# EAGLE design ModemPLN_V2wired (EAGLE 9.6.2)
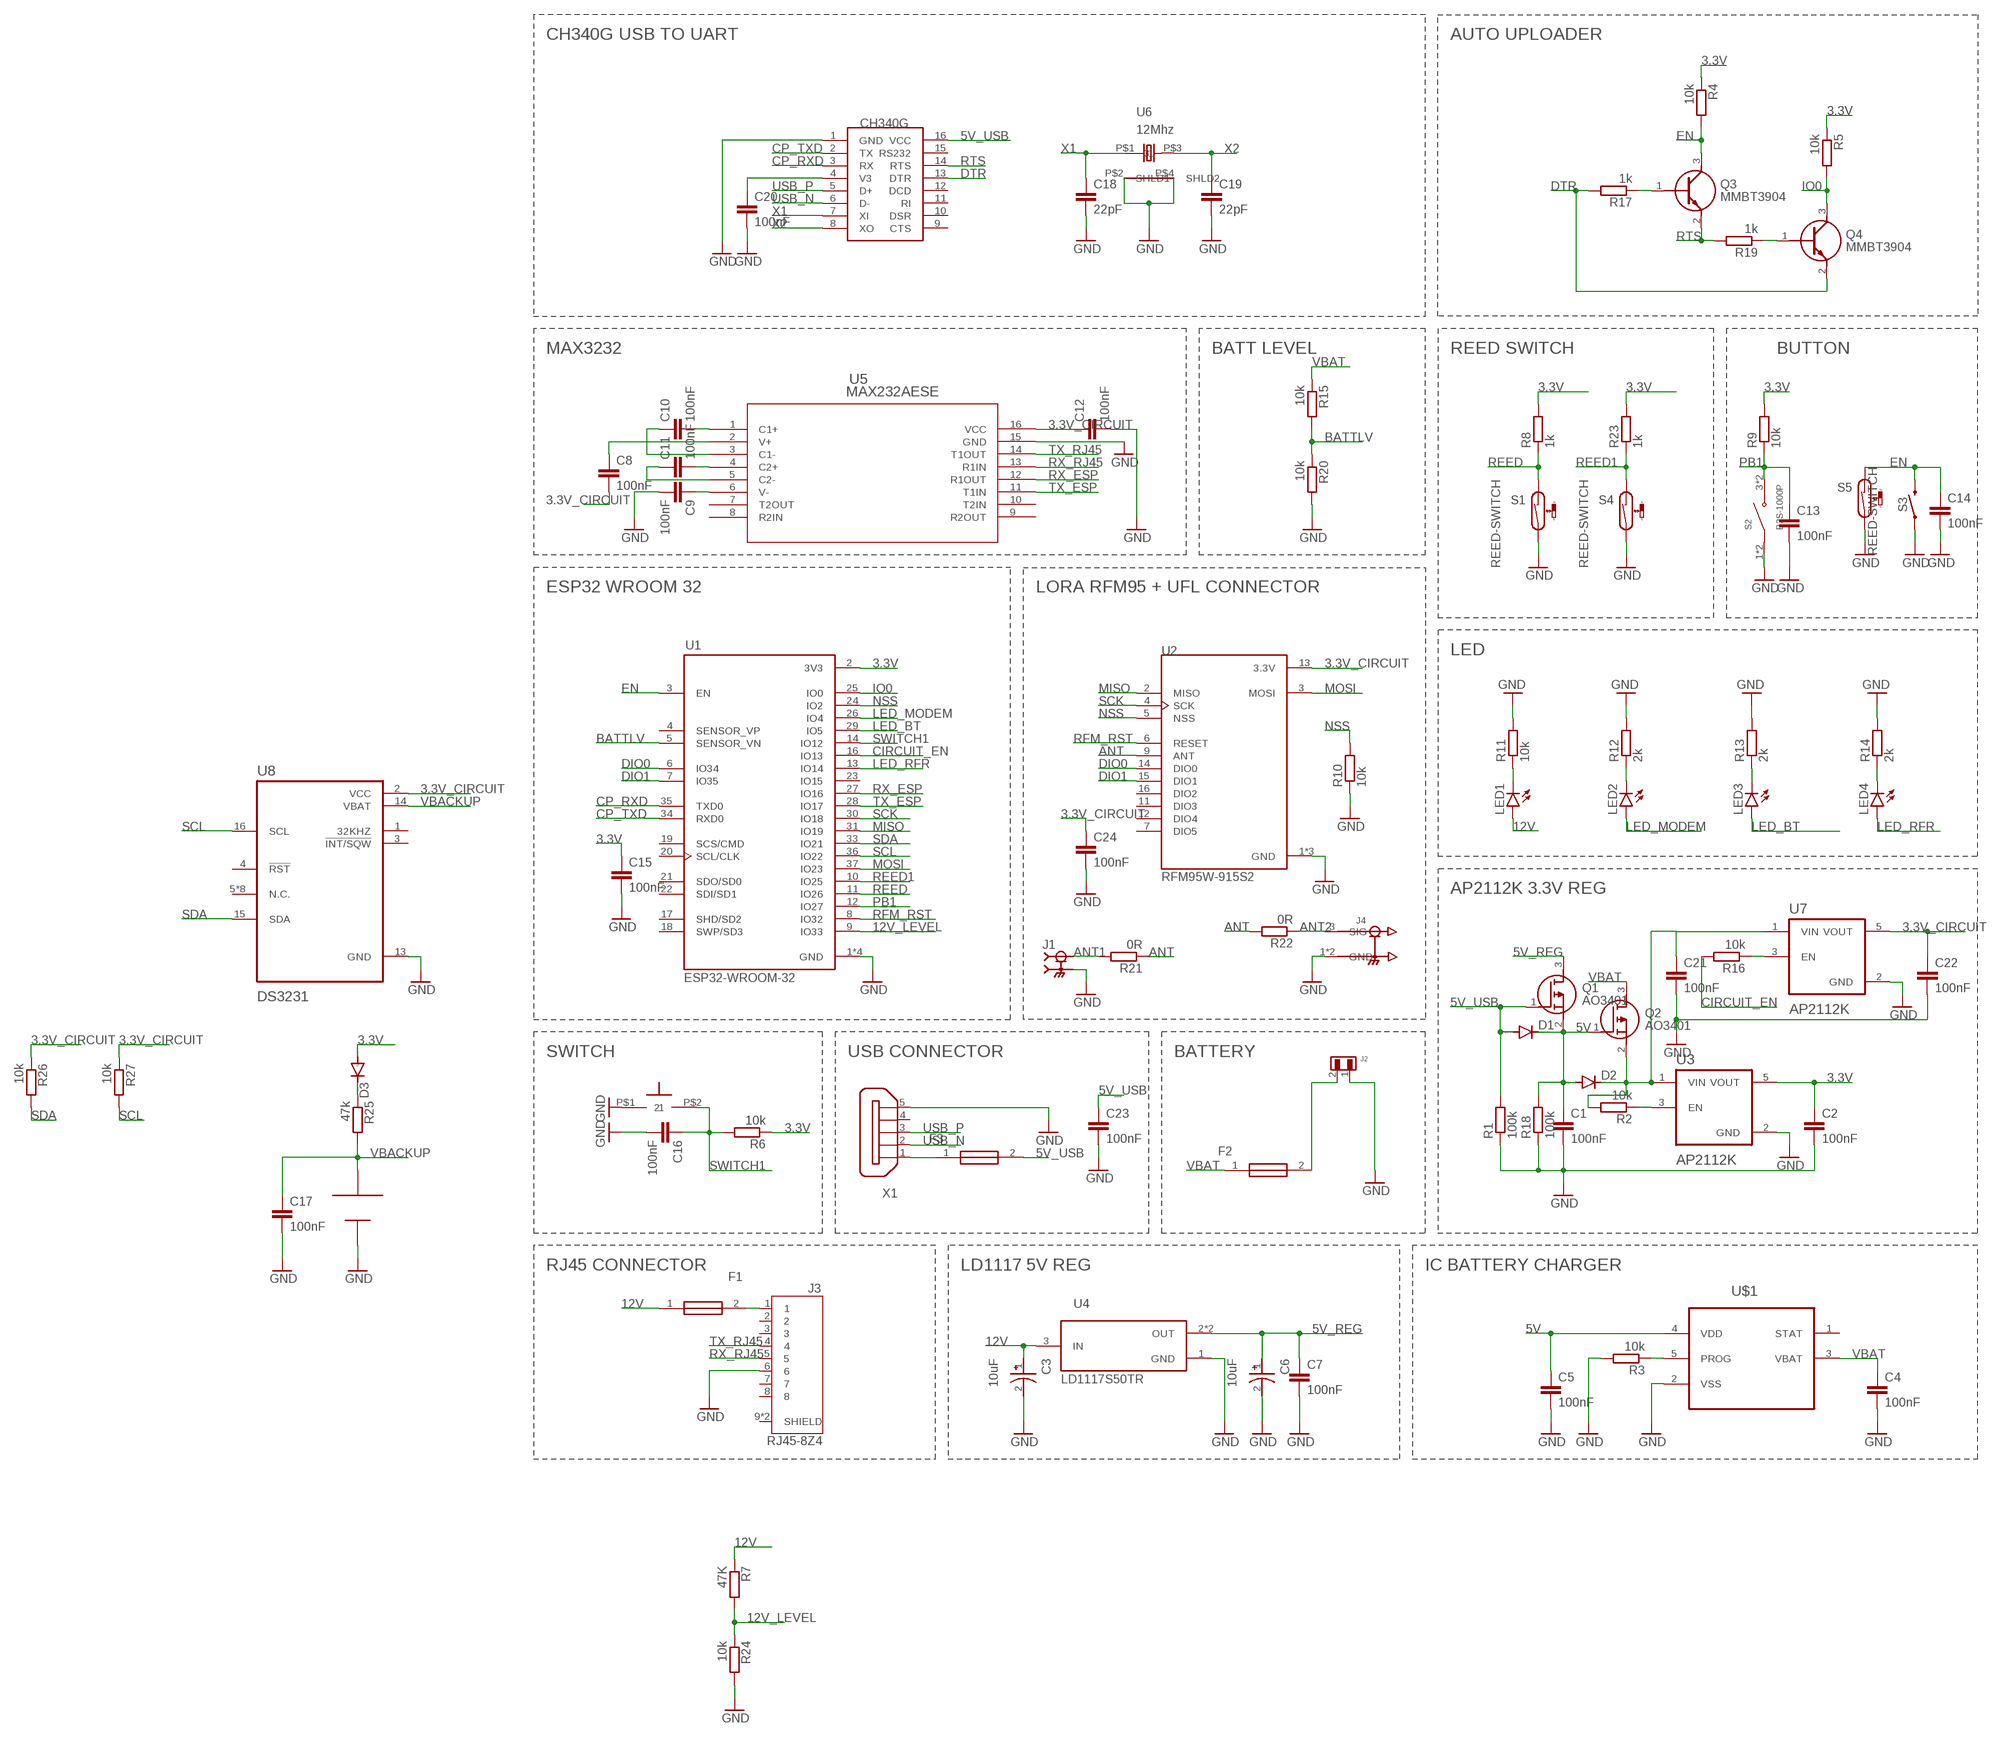
[diagram p0: schematic, sheet 1]

## Parts
C1  100nF  C-EUC0603  [C0603]
C2  100nF  C-EUC0603  [C0603]
C3  10uF  T543B106M025ATS100  [CAPPM3528X210N]
C4  100nF  C-EUC0603  [C0603]
C5  100nF  C-EUC0603  [C0603]
C6  10uF  T543B106M025ATS100  [CAPPM3528X210N]
C7  100nF  C-EUC0603  [C0603]
C8  100nF  C-EUC0603  [C0603]
C9  100nF  C-EUC0603  [C0603]
C10  100nF  C-EUC0603  [C0603]
C11  100nF  C-EUC0603  [C0603]
C12  100nF  C-EUC0603  [C0603]
C13  100nF  C-EUC0603  [C0603]
C14  100nF  C-EUC0603  [C0603]
C15  100nF  C-EUC0603  [C0603]
C16  100nF  C-EUC0603  [C0603]
C17  100nF  C-EUC0603  [C0603]
C18  22pF  C-EUC0603  [C0603]
C19  22pF  C-EUC0603  [C0603]
C20  100nF  C-EUC0603  [C0603]
C21  100nF  C-EUC0603  [C0603]
C22  100nF  C-EUC0603  [C0603]
C23  100nF  C-EUC0603  [C0603]
C24  100nF  C-EUC0603  [C0603]
D1  DIODE-DO214AC  [DO214AC]
D2  DIODE-DO214AC  [DO214AC]
D3  DIODE-DO214AC  [DO214AC]
F1  MF-NSML260_12-2  [FUSC3216X100N]
F2  MF-NSML260_12-2  [FUSC3216X100N]
F3  MF-NSML260_12-2  [FUSC3216X100N]
J1  SMA-J-P-X-RA-TH1  [SAMTEC_SMA-J-P-X-RA-TH1]
J2  620102131822  [620102131822]
J3  RJ45-8Z4  [TE_RJ45-8Z4]
J4  U.FL-R-SMT(01)  [HRS_U.FL-R-SMT(01)]
LED1  LEDCHIPLED_0805  [CHIPLED_0805]
LED2  LEDCHIPLED_0805  [CHIPLED_0805]
LED3  LEDCHIPLED_0805  [CHIPLED_0805]
LED4  LEDCHIPLED_0805  [CHIPLED_0805]
Q1  AO3401  AO3401A  [SOT95P280X125-3N]
Q2  AO3401  AO3401A  [SOT95P280X125-3N]
Q3  MMBT3904  [SOT95P240X120-3N]
Q4  MMBT3904  [SOT95P240X120-3N]
R1  100k  R-EU_R0603  [R0603]
R2  10k  R-EU_R0603  [R0603]
R3  10k  R-EU_R0603  [R0603]
R4  10k  R-EU_R0603  [R0603]
R5  10k  R-EU_R0603  [R0603]
R6  10k  R-EU_R0603  [R0603]
R7  47K  R-EU_R0603  [R0603]
R8  1k  R-EU_R0603  [R0603]
R9  10k  R-EU_R0603  [R0603]
R10  10k  R-EU_R0603  [R0603]
R11  10k  R-EU_R0603  [R0603]
R12  2k  R-EU_R0603  [R0603]
R13  2k  R-EU_R0603  [R0603]
R14  2k  R-EU_R0603  [R0603]
R15  10k  R-EU_R0603  [R0603]
R16  10k  R-EU_R0603  [R0603]
R17  1k  R-EU_R0603  [R0603]
R18  100k  R-EU_R0603  [R0603]
R19  1k  R-EU_R0603  [R0603]
R20  10k  R-EU_R0603  [R0603]
R21  0R  R-EU_R0603  [R0603]
R22  0R  R-EU_R0603  [R0603]
R23  1k  R-EU_R0603  [R0603]
R24  10k  R-EU_R0603  [R0603]
R25  47k  R-EU_R0603  [R0603]
R26  10k  R-EU_R0603  [R0603]
R27  10k  R-EU_R0603  [R0603]
S1  REED-SWITCH  REED-SWITCH-MK15-B  [MK15]
S2  B3S-1000P  [SW_B3S-1000P]
S3  MOMENTARY-SWITCH-SPST-SMD-6.0X3.5MM  [TACTILE_SWITCH_SMD_6.0X3.5MM]
S4  REED-SWITCH  REED-SWITCH-MK15-B  [MK15]
S5  REED-SWITCH  REED-SWITCH-MK15-B  [MK15]
U1  ESP32-WROOM-32  ESP32-WROOM-32(8MB)  [MODULE_ESP32-WROOM-32(8MB)]
U2  RFM95W-915S2  [XCVR_RFM95W-915S2]
U3  AP2112K  AP2112K-3.3TRG1  [SOT95P285X140-5N]
U4  LD1117S50TR  [SOT230P700X180-4N]
U5  MAX232AESE  [21-0041B_16]
U6  12Mhz  NX3225SA  [NX32256A]
U7  AP2112K  AP2112K-3.3TRG1  [SOT95P285X140-5N]
U8  DS3231  DS3231S  [SOIC127P1032X265-16N]
U$1  MCP73831T-5ACI/OT  [SOT95P280X145-5N]
U$2  TACTSWITCH  [TACT]
U$3  MS621FE  [MS621FE]
U$4  CH340G  CH340G-3D  [SOIC127P600X175-16N]
X1  ZX62D-B-5PA8  [ZX62D-B-5PA8]

## Nets
3.3V: C2.1 C15.1 D3.A R4.1 R5.1 R6.1 R8.2 R9.2 R23.2 U1.2(3V3) U3.5(VOUT)
3.3V_CIRCUIT: C8.2 C12.1 C22.1 C24.1 R26.1 R27.1 U2.13(3.3V) U5.16(VCC) U7.5(VOUT) U8.2(VCC)
5V: C1.1 C5.1 D1.C D2.A Q1.2(S) Q2.1(G) R18.2 U$1.4(VDD)
5V_REG: C6.1 C7.1 Q1.3(D) U4.2(OUT) U4.4(OUT)
5V_USB: C23.1 D1.A F3.2 Q1.1(G) R1.2 U$4.16(VCC)
12V: C3.1 F1.1 LED1.A R7.1 U4.3(IN)
12V_LEVEL: R7.2 R24.1 U1.9(IO33)
ANT: R21.1 R22.2 U2.9(ANT)
ANT1: J1.1 R21.2
ANT2: J4.3(SIG) R22.1
BATTLV: R15.2 R20.1 U1.5(SENSOR_VN)
CIRCUIT_EN: R16.2 U1.16(IO13)
CP_RXD: U1.35(TXD0) U$4.3(RX)
CP_TXD: U1.34(RXD0) U$4.2(TX)
DIO0: U1.6(IO34) U2.14(DIO0)
DIO1: U1.7(IO35) U2.15(DIO1)
DTR: Q4.2(E) R17.2 U$4.13(DTR)
EN: C14.1 Q3.3(C) R4.2 S3.2 S5.1 U1.3(EN)
GND: C1.2 C2.2 C3.2 C4.2 C5.2 C6.2 C7.2 C9.2 C12.2 C13.2 C14.2 C15.2 C16.2 C17.2 C18.2 C19.2 C20.2 C21.2 C22.2 C23.2 C24.2 J1.2 J1.3 J1.4 J1.5 J2.1 J3.6 J4.1(GND) J4.2(GND) R1.1 R3.2 R10.1 R11.2 R12.2 R13.2 R14.2 R18.1 R20.2 R24.2 S1.2 S2.1(COM) S2.2(COM) S3.1 S4.2 S5.2 U1.1(GND) U1.15(GND) U1.38(GND) U1.39(GND) U2.1(GND) U2.8(GND) U2.10(GND) U3.2(GND) U4.1(GND) U5.15(GND) U6.P$2(SHLD1) U6.P$4(SHLD2) U7.2(GND) U8.13(GND) U$1.2(VSS) U$2.P$1 U$3.V- U$4.1(GND) X1.5
IO0: Q4.3(C) R5.2 U1.25(IO0)
LED_BT: LED3.A U1.29(IO5)
LED_MODEM: LED2.A U1.26(IO4)
LED_RFR: LED4.A U1.13(IO14)
MISO: U1.31(IO19) U2.2(MISO)
MOSI: U1.37(IO23) U2.3(MOSI)
N$1: LED1.C R11.1
N$2: F1.2 J3.1
N$3: R16.1 U7.3(EN)
N$4: R2.1 U3.3(EN)
N$5: R3.1 U$1.5(PROG)
N$6: C9.1 U5.6(V-)
N$7: LED2.C R12.1
N$8: C11.2 U5.4(C2+)
N$9: C11.1 U5.5(C2-)
N$10: C10.2 U5.1(C1+)
N$11: C10.1 U5.3(C1-)
N$12: LED3.C R13.1
N$13: LED4.C R14.1
N$14: C21.1 D2.C Q2.2(S) R2.2 U3.1(VIN) U7.1(VIN)
N$15: C20.1 U$4.4(V3)
N$17: C8.1 U5.2(V+)
N$18: F3.1 X1.1
N$19: D3.C R25.1
N$20: Q3.1(B) R17.1
N$23: Q4.1(B) R19.1
N$26: F2.2 J2.2
NSS: R10.2 U1.24(IO2) U2.5(NSS)
PB1: C13.1 R9.1 S2.3(NO) S2.4(NO) U1.12(IO27)
REED: R8.1 S1.1 U1.11(IO26)
REED1: R23.1 S4.1 U1.10(IO25)
RFM_RST: U1.8(IO32) U2.6(RESET)
RTS: Q3.2(E) R19.2 U$4.14(RTS)
RX_ESP: U1.27(IO16) U5.12(R1OUT)
RX_RJ45: J3.5 U5.13(R1IN)
SCK: U1.30(IO18) U2.4(SCK)
SCL: R27.2 U1.36(IO22) U8.16(SCL)
SDA: R26.2 U1.33(IO21) U8.15(SDA)
SWITCH1: C16.1 R6.2 U1.14(IO12) U$2.P$2
TX_ESP: U1.28(IO17) U5.11(T1IN)
TX_RJ45: J3.4 U5.14(T1OUT)
USB_N: U$4.6(D-) X1.2
USB_P: U$4.5(D+) X1.3
VBACKUP: C17.1 R25.2 U8.14(VBAT) U$3.V+
VBAT: C4.1 F2.1 Q2.3(D) R15.1 U$1.3(VBAT)
X1: C18.1 U6.P$1 U$4.7(XI)
X2: C19.1 U6.P$3 U$4.8(XO)
Unconnected: J3.2 J3.3 J3.7 J3.8 J3.9(SHIELD) J3.10(SHIELD) U1.4(SENSOR_VP) U1.17(SHD/SD2) U1.18(SWP/SD3) U1.19(SCS/CMD) U1.20(SCL/CLK) U1.21(SDO/SD0) U1.22(SDI/SD1) U1.23(IO15) U2.7(DIO5) U2.11(DIO3) U2.12(DIO4) U2.16(DIO2) U5.7(T2OUT) U5.8(R2IN) U5.9(R2OUT) U5.10(T2IN) U8.1(32KHZ) U8.3(!INT/SQW) U8.4(!RST) U8.5(N.C.) U8.6(N.C.) U8.7(N.C.) U8.8(N.C.) U8.9(N.C.) U8.10(N.C.) U8.11(N.C.) U8.12(N.C.) U$1.1(STAT) U$4.9(CTS) U$4.10(DSR) U$4.11(RI) U$4.12(DCD) U$4.15(RS232) X1.4 X1.S1 X1.S2 X1.S3 X1.S4

## Notes on the sheet
- CH340G USB TO UART | AUTO UPLOADER
- MAX3232 | BATT LEVEL | REED SWITCH | BUTTON
- ESP32 WROOM 32 | LORA RFM95 + UFL CONNECTOR
- LED
- AP2112K 3.3V REG
- SWITCH | USB CONNECTOR | BATTERY
- RJ45 CONNECTOR | LD1117 5V REG | IC BATTERY CHARGER

## Library data of the parts
C1 C2 C4 C5 C7-C24 = rcl:C-EU: CAPACITOR, European symbol; SPICEPREFIX: C
C3 C6 = T543B106M025ATS100:T543B106M025ATS100: Check prices <https://pricing.snapeda.com/parts/T543B106M025ATS100/KEMET/view-part?ref=eda>; AVAILABILITY: Not in stock; DESCRIPTION: CAP TANT POLY 10UF 25V 3528; MF: KEMET; MP: T543B106M025ATS100; PACKAGE: 1411 KEMET; PRICE: None
D1-D3 = diode:DIODE-: DIODE
F1-F3 = MF-NSML260_12-2:MF-NSML260_12-2: Resettable Fuses - PPTC 2.6A 12V 1206 LOW-OHMIC Source: Datasheet <https://www.bourns.com/docs/product-datasheets/mf-nsml-x.pdf>; ARROW_PART_NUMBER: MF-NSML260/12-2; ARROW_PRICE-STOCK: https://www.arrow.com/en/products/mf-nsml26012-2/bourns; DESCRIPTION: Resettable Fuses - PPTC 2.6A 12V 1206 LOW-OHMIC; HEIGHT: 1mm; MANUFACTURER_NAME: Bourns; MANUFACTURER_PART_NUMBER: MF-NSML260/12-2; MOUSER_PART_NUMBER: 652-MF-NSML260/12-2; MOUSER_PRICE-STOCK: https://www.mouser.com/Search/Refine.aspx?Keyword=652-MF-NSML260%2F12-2
J1 = SMA-J-P-X-RA-TH1:SMA-J-P-X-RA-TH1: SMA Connector Jack, Female Socket 50Ohm Through Hole, Right Angle Solder Check prices <https://pricing.snapeda.com/parts/SMA-J-P-H-RA-TH1/Samtec/view-part?ref=eda>; AVAILABILITY: In Stock; DESCRIPTION: SMA Connector Jack, Female Socket 50Ohm Through Hole, Right Angle Solder; MF: Samtec; MP: SMA-J-P-H-RA-TH1; PACKAGE: None; PRICE: None; PURCHASE-URL: https://pricing.snapeda.com/search/part/SMA-J-P-H-RA-TH1/?ref=eda
J2 = Wurth_Connectors_WR-WTB:620102131822: WR-WTB 2.00 mm SMT Male Horizontal Shrouded Header KIND PROPERTIES: Pitch:2 mm Gender:Male MATERIAL PROPERTIES: Insulator Material :PA9T Insulator Flammability Rating:UL94 V-0 Color:Beige Contact Material:Copper Alloy Contact Plating:Tin Contact Type:Stamped GENERAL INFORMATION Operating Temperature:-25 up to +85 °C Compliance: RoHS Working Voltage:100 V (AC) Withstanding Voltage:800V (AC) Contact Resistance:20 mΩ RISO:1000 MΩ CERTIFICATION UL Approval:E323964 PACKAGING PROPERTIES Packaging:Tape and Reel <https://katalog.we-online.com/media/images/v2/o33353v209%20Family_WR-WTB_6201xx131822.jpg> Details see: https://katalog.we-online.com/en/em/WTB_2_00_SMT_MALE_HORIZONTAL_SHROUDED_HEADER_6201XX131822 Updated by Yingchun,Shan 2019-11-08 2019 (C) Würth Elektronik; CONTACT-RESISTANCE: 20mOhm; DATASHEET-URL: https://www.we-online.com/catalog/datasheet/620102131822.pdf; GENDER: Male; IR: 2A; L: 8mm; MOUNT: SMT; PACKAGING: Tape and Reel; PART-NUMBER: 620102131822; PCB-CABLE-PANEL: PCB; PINS: 2; PITCH: 2mm; TOL-R: max.; TYPE: Horizontal; USE-WITH: WR-WTB 2.00 mm Female Terminal Housing; VALUE: 620102131822; WORKING-VOLTAGE: 100V(AC)
J3 = RJ45-8Z4:RJ45-8Z4: CONN MOD JACK 8P8C R/A SHIELDED Check prices <https://pricing.snapeda.com/parts/RJ45-8Z4/TE%20Connectivity/view-part?ref=eda>; AVAILABILITY: In Stock; DESCRIPTION: Jack Modular Connector 8p8c (RJ45, Ethernet) 90° Angle (Right) Shielded; MF: TE Connectivity; MP: RJ45-8Z4; PACKAGE: None; PRICE: None
J4 = U.FL-R-SMT-01:U.FL-R-SMT(01): U.FL Series 6 Ghz 50 Ohm Ultra-small SMT Coaxial Cable Receptacle Check prices <https://pricing.snapeda.com/parts/U.FL-R-SMT%2801%29/Hirose/view-part?ref=eda>; AVAILABILITY: In Stock; DESCRIPTION: U.FL (UMCC) Connector Receptacle, Male Pin 50Ohm Surface Mount Solder. RF Connectors / Coaxial Connectors; MF: Hirose; MP: U.FL-R-SMT(01); PACKAGE: None; PRICE: None
LED1-LED4 = led:LED: LED OSRAM: - CHIPLED LG R971, LG N971, LY N971, LG Q971, LY Q971, LO R971, LY R971 LH N974, LH R974 LS Q976, LO Q976, LY Q976 LO Q996 - Hyper CHIPLED LW Q18S LB Q993, LB Q99A, LB R99A - SideLED LS A670, LO A670, LY A670, LG A670, LP A670 LB A673, LV A673, LT A673, LW A673 LH A674 LY A675 LS A676, LA A676, LO A676, LY A676, LW A676 LS A679, LY A679, LG A679 - Hyper Micro SIDELED® LS Y876, LA Y876, LO Y876, LY Y876 LT Y87S - SmartLED LW L88C, LW L88S LB L89C, LB L89S, LG L890 LS L89K, LO L89K, LY L89K LS L896, LA L896, LO L896, LY L896 - TOPLED LS T670, LO T670, LY T670, LG T670, LP T670 LSG T670, LSP T670, LSY T670, LOP T670, LYG T670 LG T671, LOG T671, LSG T671 LB T673, LV T673, LT T673, LW T673 LH T674 LS T676, LA T676, LO T676, LY T676, LB T676, LH T676, LSB T676, LW T676 LB T67C, LV T67C, LT T67C, LS T67K, LO T67K, LY T67K, LW E67C LS E67B, LA E67B, LO E67B, LY E67B, LB E67C, LV E67C, LT E67C LW T67C LS T679, LY T679, LG T679 LS T770, LO T770, LY T770, LG T770, LP T770 LB T773, LV T773, LT T773, LW T773 LH T774 LS E675, LA E675, LY E675, LS T675 LS T776, LA T776, LO T776, LY T776, LB T776 LHGB T686 LT T68C, LB T68C - Hyper Mini TOPLED® LB M676 - Mini TOPLED Santana® LG M470 LS M47K, LO M47K, LY M47K Source: http://www.osram.convergy.de LUXEON: - LUMILED® LXK2-PW12-R00, LXK2-PW12-S00, LXK2-PW14-U00, LXK2-PW14-V00 LXK2-PM12-R00, LXK2-PM12-S00, LXK2-PM14-U00 LXK2-PE12-Q00, LXK2-PE12-R00, LXK2-PE12-S00, LXK2-PE14-T00, LXK2-PE14-U00 LXK2-PB12-K00, LXK2-PB12-L00, LXK2-PB12-M00, LXK2-PB14-N00, LXK2-PB14-P00, LXK2-PB14-Q00 LXK2-PR12-L00, LXK2-PR12-M00, LXK2-PR14-Q00, LXK2-PR14-R00 LXK2-PD12-Q00, LXK2-PD12-R00, LXK2-PD12-S00 LXK2-PH12-R00, LXK2-PH12-S00 LXK2-PL12-P00, LXK2-PL12-Q00, LXK2-PL12-R00 Source: www.luxeon.com KINGBRIGHT: KA-3528ASYC Source: www.kingbright.com
Q1 Q2 = AO3401A:AO3401A: 30V P-Channel MOSFET Source: Datasheet <http://www.aosmd.com/pdfs/datasheet/AO3401A.pdf>; ARROW_PART_NUMBER: AO3401A; ARROW_PRICE-STOCK: https://www.arrow.com/en/products/ao3401a/alpha-and-omega-semiconductor; DESCRIPTION: 30V P-Channel MOSFET; HEIGHT: 1.25mm; MANUFACTURER_NAME: Alpha & Omega Semiconductors; MANUFACTURER_PART_NUMBER: AO3401A
Q3 Q4 = MMBT3904:MMBT3904: Transistor GP BJT NPN 40V 0.2A SOT23 Fairchild MMBT3904 NPN Bipolar Transistor, 0.2 A, 40 V, 3-Pin SOT-23 Source: Datasheet <https://media.digikey.com/pdf/Data Sheets/ON Semiconductor PDFs/2N3904,MMBT3904,PZT3904.pdf>; ARROW_PART_NUMBER: MMBT3904; ARROW_PRICE-STOCK: https://www.arrow.com/en/products/mmbt3904/on-semiconductor; DESCRIPTION: Transistor GP BJT NPN 40V 0.2A SOT23 Fairchild MMBT3904 NPN Bipolar Transistor, 0.2 A, 40 V, 3-Pin SOT-23; HEIGHT: 1.2mm; MANUFACTURER_NAME: ON Semiconductor; MANUFACTURER_PART_NUMBER: MMBT3904; MOUSER_PART_NUMBER: 512-MMBT3904; MOUSER_PRICE-STOCK: https://www.mouser.co.uk/ProductDetail/ON-Semiconductor-Fairchild/MMBT3904?qs=UMEuL5FsraCg3xKjS4uBJQ%3D%3D
R1-R27 = rcl:R-EU_: RESISTOR, European symbol; SPICEPREFIX: R
S1 S4 S5 = switch-reed:REED-SWITCH-: Reed Sensor; MF: MEDER; MPN: MK15-B-2; OC_FARNELL: 1079484
S2 = B3S-1000P:B3S-1000P: Tactile Switch SPST-NO Top Actuated Surface Mount Check prices <https://pricing.snapeda.com/parts/B3S-1000P/Omron%20Electronics/view-part?ref=eda>; AVAILABILITY: In Stock; DESCRIPTION: Tactile Switch SPST-NO Top Actuated Surface Mount; MF: Omron Electronics; MP: B3S-1000P; PACKAGE: SMD-4 Omron Electronics Inc-EMC Div; PRICE: None
S3 = SparkFun-Switches:MOMENTARY-SWITCH-SPST: Momentary Switch (Pushbutton) - SPST Normally-open (NO) SPST momentary switches (buttons, pushbuttons). Variants PTH-12MM - 12mm square, through-hole Momentary Pushbutton Switch - 12mm Square <https://www.sparkfun.com/products/9190> (COM-09190) PTH-6.0MM, PTH-6.0MM-KIT - 6.0mm square, through-hole Mini Pushbutton Switch <https://www.sparkfun.com/products/97> (COM-00097) KIT package intended for soldering kit's - only one side of pads' copper is exposed. PTH-RIGHT-ANGLE-KIT - Right-angle, through-hole Right Angle Tactile Button <https://www.sparkfun.com/products/10791> - Used on SparkFun BigTime Watch Kit <https://www.sparkfun.com/products/11734> SMD-12MM - 12mm square, surface-mount Tactile Button - SMD (12mm) <https://www.sparkfun.com/products/12993> (COM-12993) Used on SparkFun PicoBoard <https://www.sparkfun.com/products/11888> SMD-4.5MM - 4.5mm Square Trackball Switch Used on SparkFun Blackberry Trackballer Breakout <https://www.sparkfun.com/products/13169> SMD-4.6MMX2.8MM - 4.60mm x 2.80mm, surface mount Used on SparkFun SAMD21 Mini Breakout <https://www.sparkfun.com/products/13664> SMD-5.2MM, SMD-5.2-REDUNDANT - 5.2mm square, surface-mount Mini Pushbutton Switch - SMD <https://www.sparkfun.com/products/8720> (COM-08720) Used on Arduino Pro Mini <https://www.sparkfun.com/products/11114> REDUNDANT package connects both switch circuits together SMD-6.0X3.5MM - 6.0 x 3.5mm, surface mount Momentary Reset Switch SMD <https://www.sparkfun.com/products/8229> (COM-08229) SMD-6.2MM-TALL - 6.2mm square, surface mount Tactile Button - SMD (6mm) <https://www.sparkfun.com/products/12992> Used on SparkFun Digital Sandbox <https://www.sparkfun.com/products/12651> SMD-RIGHT-ANGLE - Right-angle, surface mount Used on SparkFun Block for Intel® Edison - Arduino <https://www.sparkfun.com/products/13036>; PROD_ID: SWCH-00815; SF_SKU: COM-08229
U1 = ESP32-WROOM-32_8MB_:ESP32-WROOM-32(8MB): WIFI MODULE 64 MBITS SPI FLASH; AVAILABILITY: Unavailable; DESCRIPTION: Bluetooth, WiFi 802.11b/g/n, Bluetooth v4.2 +EDR, Class 1, 2 and 3 Transceiver Module 2.4GHz ~ 2.5GHz Surface Mount; MF: Espressif Systems; MP: ESP32-WROOM-32 (8MB); PACKAGE: Module Espressif Systems; PRICE: None
U2 = RFM95W-915S2:RFM95W-915S2: RFM95(W) - Low Power Long Range Transceiver Module V1.0; AVAILABILITY: Unavailable; DESCRIPTION: General ISM < 1GHz LoRa™ Transceiver Module 915MHz Surface Mount; MF: RF Solutions; MP: RFM95W-915S2; PACKAGE: SMD-16 RF Solutions; PRICE: None
U3 U7 = AP2112K-3.3TRG1:AP2112K-3.3TRG1: AP2112 Series 0.6 A 3.3 V Fixed Output SMT LDO Linear Regulator - SOT23-5; AVAILABILITY: Unavailable; DESCRIPTION: Linear Voltage Regulator IC 1 Output 600mA SOT-25; MF: Diodes Inc.; MP: AP2112K-3.3TRG1; PACKAGE: SOT-753 Diodes Inc.; PRICE: None
U4 = LD1117S50TR:LD1117S50TR: LDO Voltage Regulators 3.3V 0.8A Positive Check prices <https://pricing.snapeda.com/parts/LD1117S50TR/STMicroelectronics/view-part?ref=eda>; AVAILABILITY: Good; DESCRIPTION: Linear Voltage Regulator IC 1 Output 800mA SOT-223; MF: STMicroelectronics; MP: LD1117S50TR; PACKAGE: SOT-223 STMicroelectronics; PRICE: None; PURCHASE-URL: https://pricing.snapeda.com/search/part/LD1117S50TR/?ref=eda
U5 = MAX232AESE:MAX232AESE: Check prices <https://pricing.snapeda.com/parts/MAX232AESE/Maxim%20Integrated/view-part?ref=eda>; AVAILABILITY: Warning; DESCRIPTION: 2/2 Transceiver Full RS232 16-SOIC; MF: Maxim Integrated; MP: MAX232AESE; PACKAGE: SOIC-16 Maxim Integrated; PRICE: None; PURCHASE-URL: https://pricing.snapeda.com/search/part/MAX232AESE/?ref=eda
U6 = NX3225SA:NX3225SA: SMD crystal; AVAILABILITY: Unavailable; DESCRIPTION: 12MHz ±15ppm Crystal 8pF 100 Ohms 4-SMD, No Lead; MF: NDK America,; MP: NX3225SA; PACKAGE: SMD-4 NDK America,; PRICE: None
U8 = DS3231S:DS3231S: Check prices <https://pricing.snapeda.com/parts/DS3231S/Maxim%20Integrated/view-part?ref=eda>; AVAILABILITY: Warning; DESCRIPTION: Real Time Clock (RTC) IC Clock/Calendar I²C, 2-Wire Serial 16-SOIC (0.295, 7.50mm Width); MF: Maxim Integrated; MP: DS3231S; PACKAGE: SOIC-16 Maxim Integrated; PRICE: None; PURCHASE-URL: https://pricing.snapeda.com/search/part/DS3231S/?ref=eda
U$1 = MCP73831T-5ACI_OT:MCP73831T-5ACI/OT: Charge Management Controller Check prices <https://pricing.snapeda.com/parts/MCP73831T-5ACI/OT/Microchip/view-part?ref=eda>; AVAILABILITY: Good; DESCRIPTION: Charger IC Lithium Ion/Polymer SOT-23-5; MF: Microchip; MP: MCP73831T-5ACI/OT; PACKAGE: SOT-23-5 Microchip; PRICE: None; PURCHASE-URL: https://pricing.snapeda.com/search/part/MCP73831T-5ACI/OT/?ref=eda
U$2 = tactswitch:TACTSWITCH
U$3 = MS621FE:MS621FE
U$4 = ch340g:CH340G-3D
X1 = microusb 5p:ZX62D-B-5PA8: Micro USB Type B Connector - Standard, Shell Through Hole Source: http://www.hirose.co.jp/cataloge_hp/ed_ZX_20140804.pdf; MF: Hirose; MPN: ZX62D-B-5PA8; OC_FARNELL: 2300438; OC_NEWARK: 69W0712

## Board
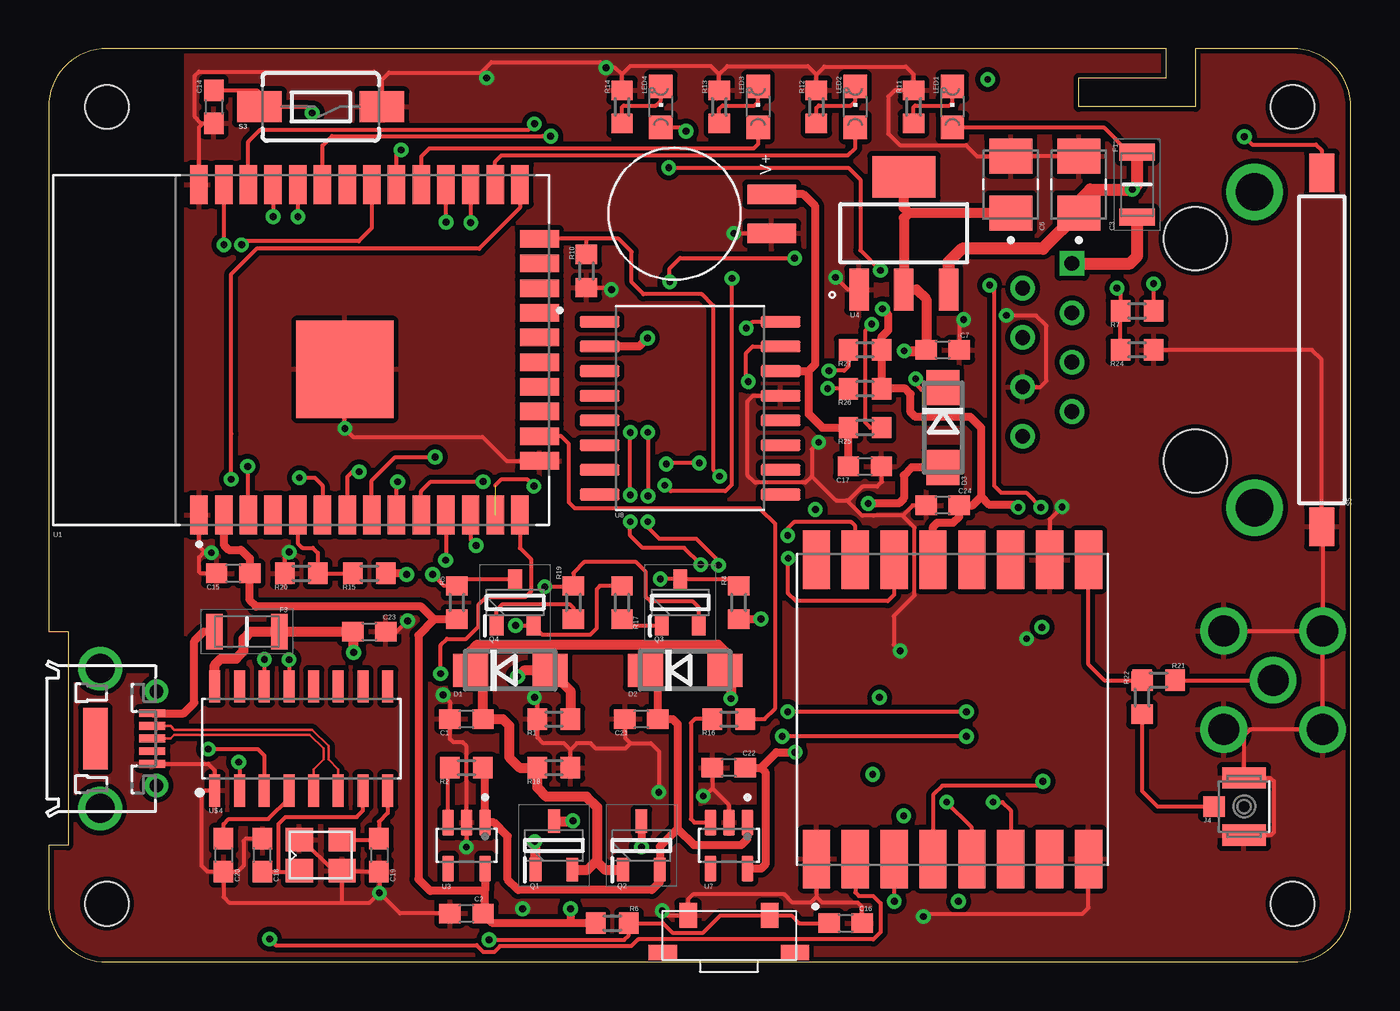
[diagram p1: board, top side]
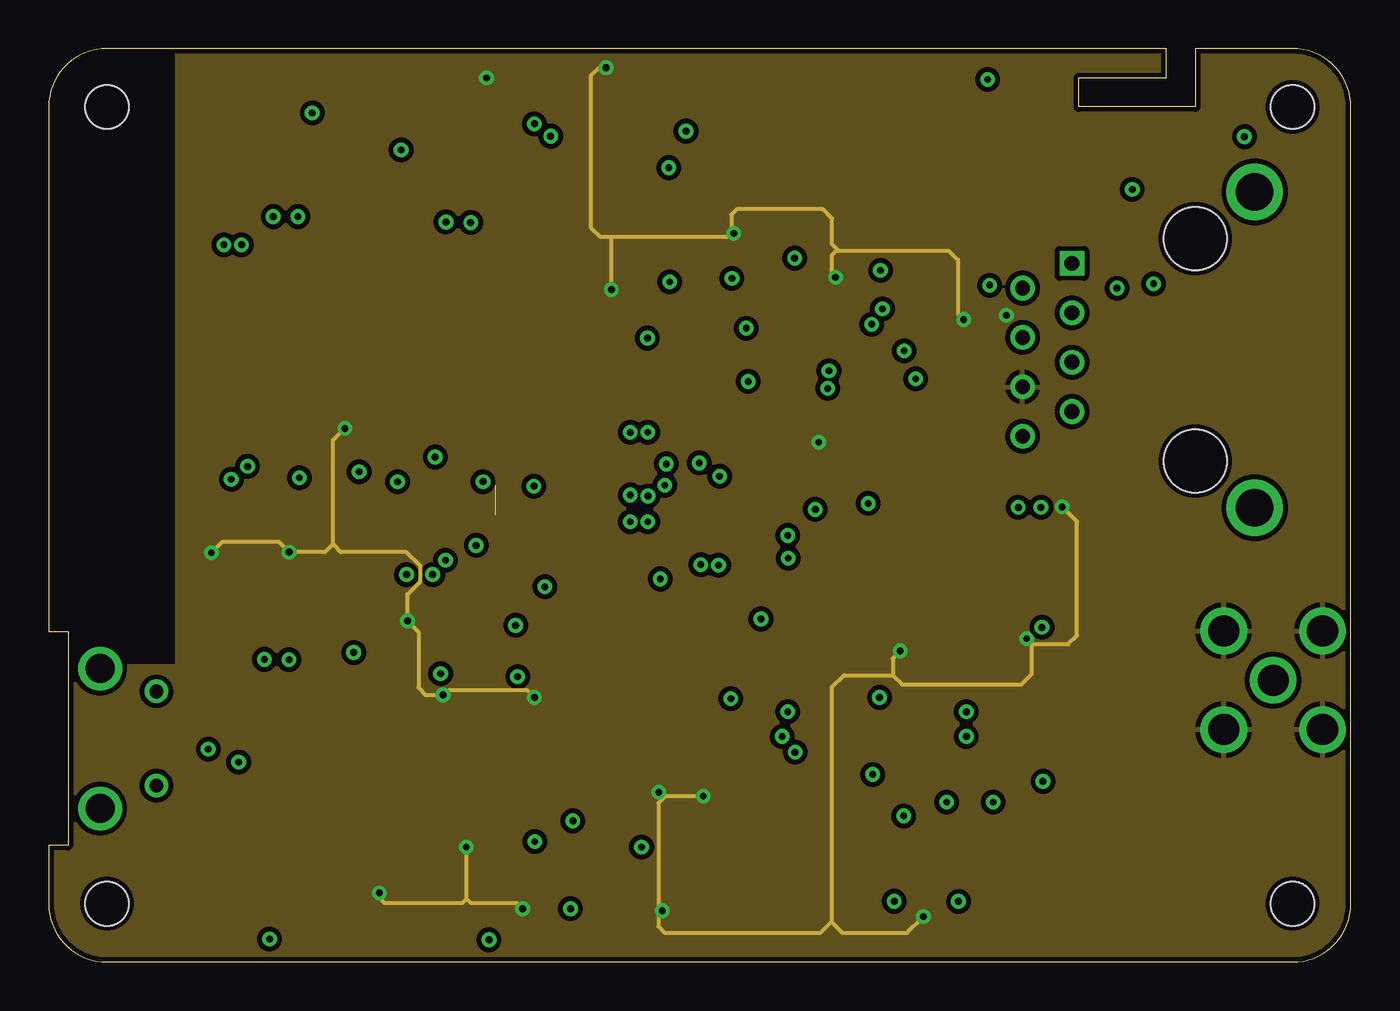
[diagram p2: board, inner layer Route2]
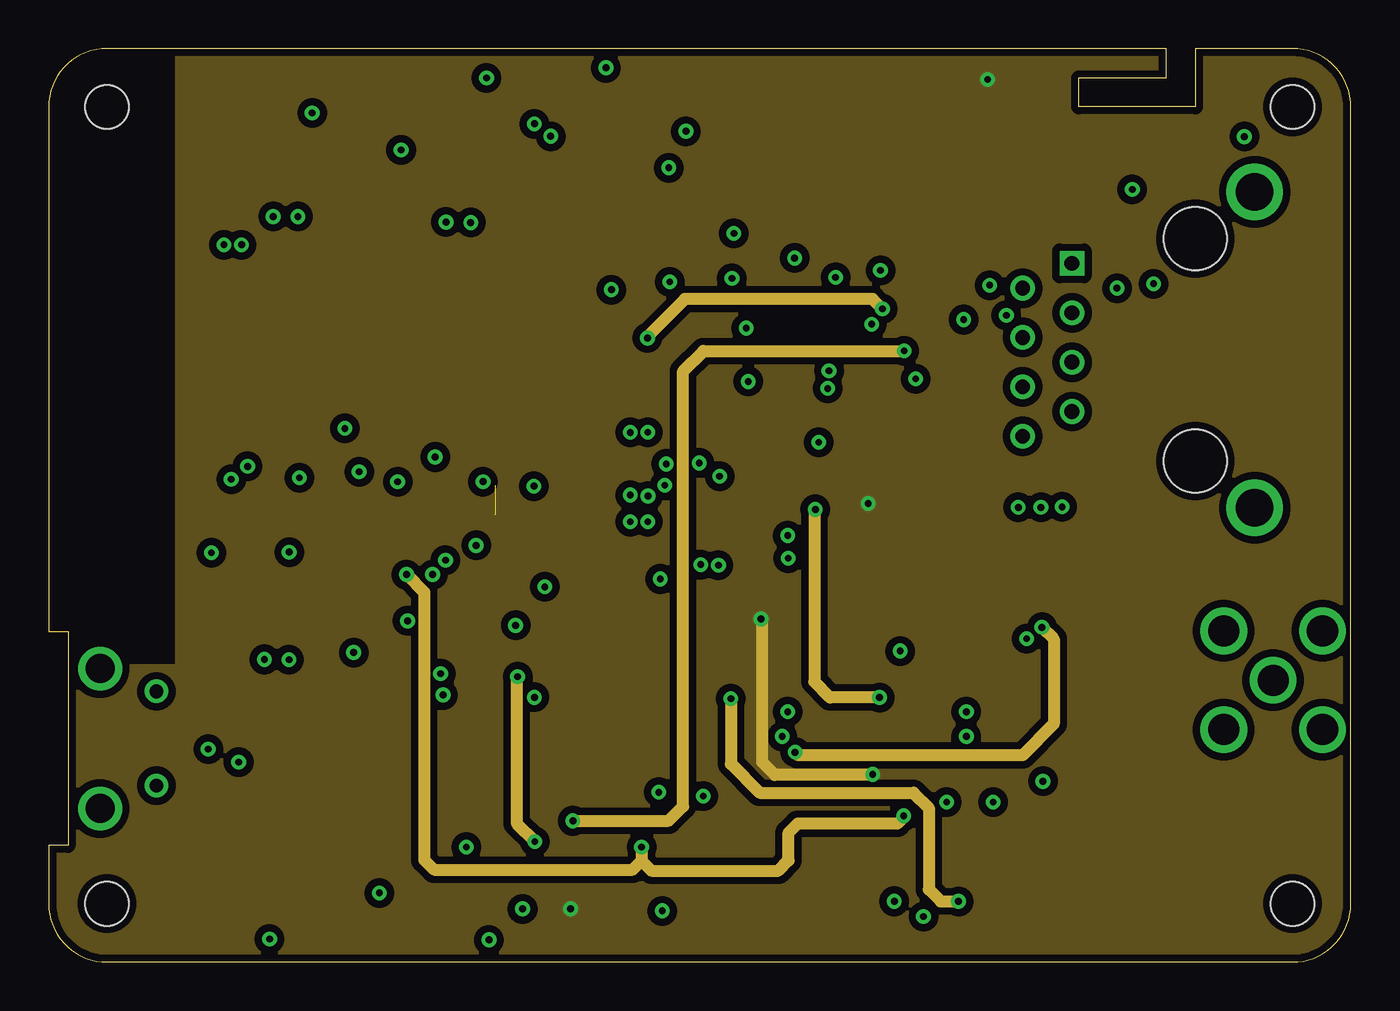
[diagram p3: board, inner layer Route15]
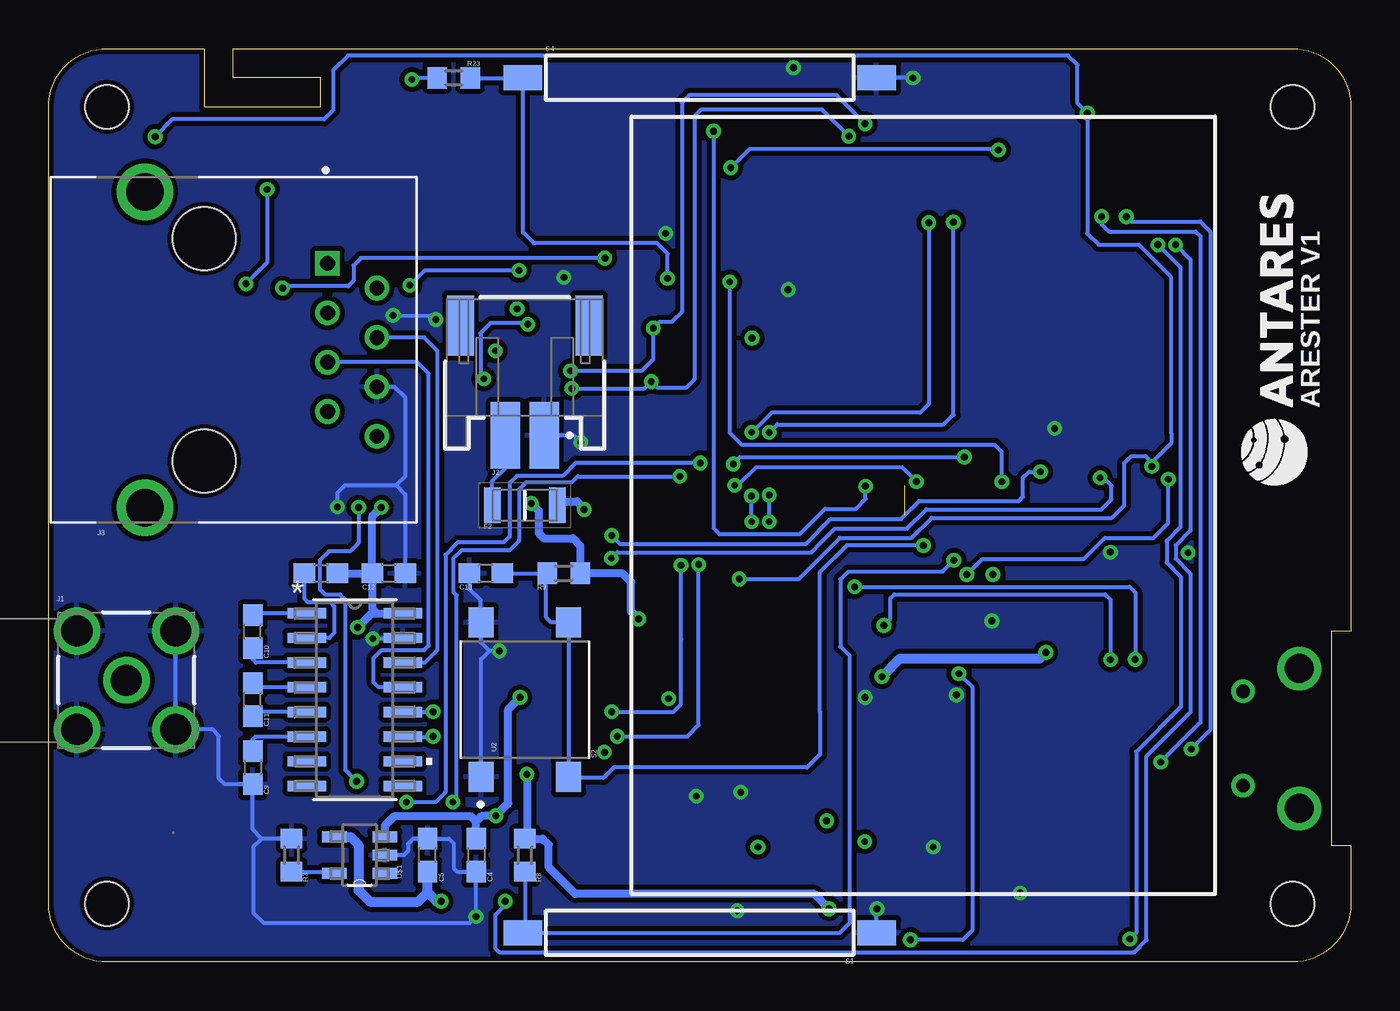
[diagram p4: board, bottom side, seen from below]

Size 67 x 47 mm. Coordinates in mm from the lower left corner, seen from the top.
Outline: 0,17 1,17 1,6 0,6 0,3 arc90 3,0 64,0 arc90 67,3 67,44 arc90 64,47 59,47 59,44 53,44 53,45.5 57.5,45.5 57.5,47 3,47 arc90 0,44 0,17
Copper layers (1+2*15+16): Top 0.035mm / dielectric 0.2mm / Route2 0.0175mm / dielectric 0.665mm / Route15 0.0175mm / dielectric 0.2mm / Bottom 0.035mm
Design rules "default *": minimum track width 5mil, minimum drill 0.25mm, track to track 5mil, track to pad 6mil, pad to pad 6mil, via to via 6mil, smd to smd 6mil, copper to edge 10mil, drill to drill 6mil, minimum pad ring 10mil, minimum via ring 8mil, stop-mask expansion 4mil, vias tented up to drill 25mil, thermal gap 10mil
Holes 2.25 mm at 3,44 3,3 64,44 64,3
Holes 3.25 mm at 59,25.79 59,37.22
tRestrict: 5 lines
bRestrict: 4 lines

### Footprints (pad centres in the part's own frame; a part is rotated, then mirrored left to right if it is on the bottom)
C0603 = smd 1.1 x 1: 1 -0.85,0; 2 0.85,0
CAPPM3528X210N = smd 1.79 x 2.21: 1 -1.46,0; 2 1.46,0
DO214AC = smd 1.8 x 1.7: A 2.05,0; C -2.05,0
FUSC3216X100N = smd 0.86 x 1.82: 1 -1.675,0; 2 1.675,0
SAMTEC_SMA-J-P-X-RA-TH1 = drill 1.6: 1 0,0; 2 2.54,-2.54; 3 2.54,2.54; 4 -2.54,2.54; 5 -2.54,-2.54
620102131822 = smd 1.5 x 3.4: 1 -1,2.9; 2 1,2.9 | smd 1.4 x 3.1: Z1 -3.3,-2.75; Z2 3.3,-2.75
TE_RJ45-8Z4 = drill 0.76 square: 1 -4.445,6.35 | drill 0.76: 2 -3.175,8.89; 3 -1.905,6.35; 4 -0.635,8.89; 5 0.635,6.35; 6 1.905,8.89; 7 3.175,6.35; 8 4.445,8.89 | drill 1.93: 9 -8.125,-3.05; 10 8.125,-3.05 | hole 3.25: 5.715,0; -5.715,0
HRS_U.FL-R-SMT(01) = smd 1.1 x 2.25: 1 -1.475,0; 2 1.475,0 | smd 1.05 x 1.1: 3 0,-1.55
CHIPLED_0805 = smd 1.2 x 1.2: A 0,-1.05; C 0,1.05
SOT95P280X125-3N = smd 1.2 x 0.6: 1 -1.25,0.95; 2 -1.25,-0.95; 3 1.25,0
SOT95P240X120-3N = smd 1 x 0.7: 1 -1.2,0.95; 2 -1.2,-0.95; 3 1.2,0
R0603 = smd 1 x 1.1: 1 -0.85,0; 2 0.85,0
MK15 = smd 2 x 1.3: 1 -9.1,0; 2 9.1,0
SW_B3S-1000P = smd 1.55 x 1.3: 1 -3.975,2.25; 2 3.975,2.25; 3 -3.975,-2.25; 4 3.975,-2.25
TACTILE_SWITCH_SMD_6.0X3.5MM = smd 2.3 x 1.6: 1 -3.15,0; 2 3.15,0
MODULE_ESP32-WROOM-32(8MB) = smd 2 x 0.9: 1 -8.5,5.26; 2 -8.5,3.99; 3 -8.5,2.72; 4 -8.5,1.45; 5 -8.5,0.18; 6 -8.5,-1.09; 7 -8.5,-2.36; 8 -8.5,-3.63; 9 -8.5,-4.9; 10 -8.5,-6.17; 11 -8.5,-7.44; 12 -8.5,-8.71; 13 -8.5,-9.98; 14 -8.5,-11.25; 25 8.5,-11.25; 26 8.5,-9.98; 27 8.5,-8.71; 28 8.5,-7.44; 29 8.5,-6.17; 30 8.5,-4.9; 31 8.5,-3.63; 32 8.5,-2.36; 33 8.5,-1.09; 34 8.5,0.18; 35 8.5,1.45; 36 8.5,2.72; 37 8.5,3.99; 38 8.5,5.26 | smd 0.9 x 2: 15 -5.715,-12.25; 16 -4.445,-12.25; 17 -3.175,-12.25; 18 -1.905,-12.25; 19 -0.635,-12.25; 20 0.635,-12.25; 21 1.905,-12.25; 22 3.175,-12.25; 23 4.445,-12.25; 24 5.715,-12.25 | smd 5 x 5: 39 -1,-2.24
XCVR_RFM95W-915S2 = smd 3 x 1.4: 1 -7.7,7; 2 -7.7,5; 3 -7.7,3; 4 -7.7,1; 5 -7.7,-1; 6 -7.7,-3; 7 -7.7,-5; 8 -7.7,-7; 9 7.7,-7; 10 7.7,-5; 11 7.7,-3; 12 7.7,-1; 13 7.7,1; 14 7.7,3; 15 7.7,5; 16 7.7,7
SOT95P285X140-5N = smd 1.35 x 0.6: 1 -1.185,0.95; 2 -1.185,0; 3 -1.185,-0.95; 4 1.185,-0.95; 5 1.185,0.95
SOT230P700X180-4N = smd 2.15 x 1: 1 -2.9,2.3; 2 -2.9,0; 3 -2.9,-2.3 | smd 2.15 x 3.25: 4 2.9,0
21-0041B_16 = smd 1.981 x 0.533: 1 -2.464,4.445; 2 -2.464,3.175; 3 -2.464,1.905; 4 -2.464,0.635; 5 -2.464,-0.635; 6 -2.464,-1.905; 7 -2.464,-3.175; 8 -2.464,-4.445; 9 2.464,-4.445; 10 2.464,-3.175; 11 2.464,-1.905; 12 2.464,-0.635; 13 2.464,0.635; 14 2.464,1.905; 15 2.464,3.175; 16 2.464,4.445
NX32256A = smd 1.4 x 1.2: P$1 -1.1,-0.8; P$2 1.1,-0.8; P$3 1.1,0.8; P$4 -1.1,0.8
SOIC127P1032X265-16N = smd 2.05 x 0.59: 1 -4.655,4.445; 2 -4.655,3.175; 3 -4.655,1.905; 4 -4.655,0.635; 5 -4.655,-0.635; 6 -4.655,-1.905; 7 -4.655,-3.175; 8 -4.655,-4.445; 9 4.655,-4.445; 10 4.655,-3.175; 11 4.655,-1.905; 12 4.655,-0.635; 13 4.655,0.635; 14 4.655,1.905; 15 4.655,3.175; 16 4.655,4.445
SOT95P280X145-5N = smd 1.27 x 0.559: 1 -1.295,0.94; 2 -1.295,0; 3 -1.295,-0.94; 4 1.295,-0.94; 5 1.295,0.94
TACT = smd 0.9 x 1.27: P$1 -2.1,0.9; P$2 2.1,0.9 | smd 1.45 x 0.8: P$3 -3.4,-1; P$4 3.4,-1
MS621FE = smd 1 x 2.5: V+ 1,-1.2; V- -1,-1.2
SOIC127P600X175-16N = smd 1.655 x 0.568: 1 -2.678,4.445; 2 -2.678,3.175; 3 -2.678,1.905; 4 -2.678,0.635; 5 -2.678,-0.635; 6 -2.678,-1.905; 7 -2.678,-3.175; 8 -2.678,-4.445; 9 2.678,-4.445; 10 2.678,-3.175; 11 2.678,-1.905; 12 2.678,-0.635; 13 2.678,0.635; 14 2.678,1.905; 15 2.678,3.175; 16 2.678,4.445
ZX62D-B-5PA8 = smd 1.35 x 0.4: 1 4.825,1.3; 2 4.825,0.65; 3 4.825,0; 4 4.825,-0.65; 5 4.825,-1.3 | smd 1.27 x 3.175: P$1 1.905,0 | drill 1.5: S1 2.15,-3.6; S2 2.15,3.6 | drill 0.7: S3 5.05,2.425; S4 5.05,-2.425

### Placement (x,y rotation side)
C1  21.5,12.5 180 top
C2  21.5,2.5 180 top
C3  53,40 90 top
C4  45,5.5 270 bottom
C5  47.5,5.5 90 bottom
C6  49.5,40 90 top
C7  46,31.5 0 top
C8  53,20 0 bottom
C9  56.5,10 270 bottom
C10  56.5,17 90 bottom
C11  56.5,13.5 90 bottom
C12  49.5,20 0 bottom
C13  44.5,20 180 bottom
C14  8.5,44 270 top
C15  9.5,20 180 top
C16  41,2 0 top
C17  42,25.5 0 top
C18  11,5.5 90 top
C19  17,5.5 270 top
C20  9,5.5 270 top
C21  30.5,12.5 180 top
C22  35,10 180 top
C23  16.5,17 0 top
C24  46,23.5 180 top
D1  23.75,15 0 top
D2  32.75,15 0 top
D3  46,27.5 270 top
F1  56,40 270 top
F2  42.5,23.5 180 bottom
F3  10.2,17 0 top
J1  63,14.5 0 bottom
J2  42.5,30 180 bottom
J3  59,31.5 270 bottom
J4  61.5,8 270 top
LED1  46.5,44 0 top
LED2  41.5,44 0 top
LED3  36.5,44 0 top
LED4  31.5,44 0 top
Q1  26,6 90 top
Q2  30.5,6 90 top
Q3  32.5,18.5 90 top
Q4  24,18.5 90 top
R1  26,12.5 0 top
R2  21.5,10 0 top
R3  54.5,5.5 90 bottom
R4  35.5,18.5 90 top
R5  21,18.5 90 top
R6  29,2 0 top
R7  56,33.5 180 top
R8  42.5,5.5 90 bottom
R9  40.5,20 0 bottom
R10  27.67,35.55 90 top
R11  44.5,44 90 top
R12  39.5,44 90 top
R13  34.5,44 90 top
R14  29.5,44 90 top
R15  16.5,20 180 top
R16  35,12.5 0 top
R17  29.5,18.5 90 top
R18  26,10 180 top
R19  27,18.5 90 top
R20  13,20 180 top
R21  57.1,14.5 0 top
R22  56.25,13.6 90 top
R23  46.16,45.49 180 bottom
R24  56,31.5 0 top
R25  42,27.5 180 top
R26  42,29.5 180 top
R27  42,31.5 180 top
S1  33.5,1.5 0 bottom
S2  42.5,13.5 90 bottom
S3  14,44 180 top
S4  33.5,45.5 0 bottom
S5  65.5,31.5 270 top
U1  13,31.5 90 top
U2  46.5,13 90 top
U3  21.5,6 270 top
U4  44,37.5 90 top
U5  51.25,13.5 0 bottom
U6  14,5.5 0 top
U7  35,6 270 top
U8  33,28.5 0 top
U$1  51,5.5 180 bottom
U$2  35,1.5 0 top
U$3  36,38.5 90 top
U$4  13,11.5 90 top
X1  0.5,11.5 0 top

### Tracks (layer width: path | path; a pad name or v marks a point on that pad's centre or on a via)
3.3V  (via drill 0.35)
  Top 0.406: U1.2 9.01,21.47 9.27,21.21 9.91,21.21 10.35,20.77 C15.1 10.35,18.61 10.67,18.29 19.18,18.29 19.82,17.65 | 19.82,17.65 R5.1 | v26.86,2.74 v26.85,2.74 26.85,2 | R4.1 v36.65,17.65 | D3.A 44.4,25.45 43.99,25.04 43.99,23.85 43.74,23.6 v42.16,23.6 | 19.82,17.65 19.82,17.61 19.02,16.82 19.02,4.27 19.63,3.66 22.45,3.66 | R6.1 26.85,2 | 26.85,2 22.85,2 C2.1 22.45,2.6 22.45,3.66 | U3.5 22.45,3.66
  Route15 0.406: v36.65,17.65 36.7,17.6 | v42.39,9.65 42.37,9.63
  Route15 0.61: 36.7,17.6 36.7,10.29 37.36,9.63 42.37,9.63
  Bottom 0.203: R23.2 48.24,45.49 v48.31,45.41
  Bottom 0.406: v26.85,2.74 27.61,3.5 39.9,3.5 41.27,4.88 41.27,6.04 41.58,6.35 R8.2 42.39,6.46 v42.39,9.65 | v36.65,17.65 37.03,18.03 37.03,19.56 37.48,20 R9.2 39.65,21.41 40.03,21.79 41.5,21.79 41.78,22.07 41.78,23.22 v42.16,23.6
  pour Route15 (isolate 0.381): 6.6,47 6.6,15.2 4.7,15.2 0,15.2 0,13.1 0,0 1.9,0 67,0 67,5.1 67,47 60.2,47
3.3V_CIRCUIT  (via drill 0.35)
  Top 0.406: U7.5 36.67,4.82 36.91,5.05 36.91,9.73 36.63,10 | C22.1 36.63,10 | U2.13 45.5,22.39 45.72,22.61 46.53,22.61 46.85,22.92 C24.1 47.53,23.5 47.98,23.95 | 47.98,23.95 47.98,27.48 47.42,28.04 44.6,28.04 44.35,28.3 44.35,29.23 44.08,29.5 R26.1 R27.1 42.85,32.16 43.2,32.51 43.2,33.3 v42.9,33.6 | v49.89,23.39 49.76,23.52 48.41,23.52 47.98,23.95 | 36.63,10 36.65,10 37.44,10.79 v38.41,10.79 | v30.81,32.11 30.38,31.68 U8.2
  Route15 0.61: v38.41,10.79 38.56,10.64 50.11,10.64 51.71,12.24 51.71,16.61 v51.1,17.22 | v42.9,33.6 42.39,34.11 32.74,34.11 30.81,32.18 v30.81,32.11
  Bottom 0.406: C8.2 C12.1 | C12.1 50.35,22.93 v49.89,23.39 | C12.1 50.35,18.17 50.13,17.95 | 50.13,17.95 U5.16 | v51.1,17.22 50.38,17.95 50.13,17.95
5V  (via drill 0.35)
  Top 0.508: Q1.2 27.74,4.75 28.22,5.23 | Q2.1 28.63,4.75 28.22,5.16 28.22,5.23 | 28.22,5.23 28.22,7.98 27.69,8.51 25.6,8.51 25.15,8.96 R18.2 24.24,10 23.7,10.54 23.7,12.17 23.36,12.5 C1.1 22.35,14.35 D1.C 21.7,15.98 22.05,16.33 34.44,16.33 34.8,15.97 D2.A 35.1,14.7 v35.1,13.55
  Route15 0.61: v35.1,13.55 35.1,10.19 36.58,8.71 44.5,8.71 45.29,7.92 45.29,3.73 45.9,3.12 v46.81,3.12
  Bottom 0.508: U$1.4 51.47,6.44 51.05,6.02 51.05,3.68 50.47,3.1 47.98,3.1 47.5,3.58 | 47.5,3.58 C5.1 | v46.81,3.12 47.04,3.12 47.5,3.58
5V_REG  (via drill 0.35)
  Top 0.508: C6.1 44.26,38.54 | U4.4 44,38.8 44.26,38.54 | 44.26,38.54 44,38.28 U4.2 44.65,34.6 45.15,34.1 C7.1 45.09,31.45 v44.02,31.45 | Q1.3 v26.96,7.25 v26.98,7.26
  Route15 0.61: v26.98,7.26 31.9,7.26 32.64,8 32.64,30.4 33.68,31.45 v44.02,31.45
5V_USB  (via drill 0.35)
  Top 0.508: U$4.16 8.55,15.29 8.89,15.62 9.65,15.62 10.03,16 10.03,16.64 10.4,17 F3.2 C23.1 15.7,16.95 v15.7,15.93 | R1.2 26.85,13.95 D1.A 24.45,15 v24.13,14.68 | v25.02,6.2 25.02,4.78 Q1.1
  Route15 0.508: v24.13,14.68 24.08,14.63
  Route15 0.61: 24.08,14.63 24.08,7.14 v25.02,6.2
  Bottom 0.508: v24.13,14.68 23.19,15.62 16,15.62 v15.7,15.93
12V  (via drill 0.35)
  Top 0.203: v56.84,34.9 R7.1 | LED1.A 54.28,42.95 55.56,41.67 F1.1
  Top 0.61: F1.1 56.01,40.01 v55.75,39.75 53.59,39.75 53,39.16 C3.1 51.16,36.7 46.99,36.7 46.3,36.01 U4.3
  Bottom 0.203: v55.75,39.75 55.75,35.99 v56.84,34.9
12V_LEVEL  (via drill 0.35)
  Top 0.203: R24.1 R7.2 55.15,34.49 v54.97,34.67 | U1.9 17.9,24.66 v17.96,24.71 | v31.95,35 31.95,35.69 32.49,36.22 v38.38,36.22
  Bottom 0.203: v17.96,24.71 17.96,26.24 18.34,26.62 31.34,26.62 31.95,27.23 v31.95,35 | v38.38,36.22 50.93,36.22 51.31,35.84 51.31,35.05 51.59,34.77 54.86,34.77 v54.97,34.67
ANT
  Top 0.213: U2.9 53.5,15.31 54.31,14.5 R21.1 R22.2
ANT1
  Top 0.213: R21.2 J1.1
ANT2
  Top 0.213: R22.1 56.25,8.8 57.05,8 J4.3
BATTLV
  Top 0.203: U1.5 12.82,21.55 13.06,21.31 13.59,21.31 13.85,21.05 R20.1 R15.2
CIRCUIT_EN
  Top 0.203: R16.2 36.83,12.5 37.39,13.06 37.39,22.53 36.58,23.34 27.08,23.34 26.77,23.65 26.77,26.64 26.36,27.05 U1.16
CP_RXD  (via drill 0.35)
  Top 0.203: U1.35 v11.55,38.36 v11.56,38.35 | v8.21,10.96 10.76,10.96 11.1,10.62 U$4.3
  Bottom 0.203: v11.56,38.35 11.3,38.1 7.75,38.1 7.24,37.59 7.24,11.93 v8.21,10.96
CP_TXD  (via drill 0.35)
  Top 0.203: U1.34 v12.82,38.36 v12.83,38.35 | v9.78,10.29 9.82,10.24 U$4.2
  Bottom 0.203: v12.83,38.35 12.83,37.97 12.45,37.59 8,37.59 7.75,37.34 7.75,12.32 v9.78,10.29
DIO0  (via drill 0.35)
  Top 0.203: U2.14 43.5,18.89 43.18,18.57 38.46,18.57 38.05,18.97 v38.05,20.78 | v12.9,24.92 13.69,24.92 14.09,24.52 U1.6
  Bottom 0.203: v38.05,20.78 37.74,21.08 27.76,21.08 27.25,21.59 27.15,21.69 26.54,22.3 22.84,22.3 21.84,23.29 12.83,23.29 12.32,23.8 12.32,24.51 12.72,24.92 v12.9,24.92
DIO1  (via drill 0.35)
  Top 0.203: U2.15 41.5,22.43 41.3,22.63 38.35,22.63 38.02,22.3 v38.02,21.95 | v15.98,25.22 15.62,25.22 15.36,24.96 U1.7
  Bottom 0.203: v38.02,21.95 37.59,21.51 28.04,21.51 26.77,22.78 23.14,22.78 22.2,23.72 17.09,23.72 16.87,23.95 16.87,24.92 16.56,25.22 v15.98,25.22
DTR  (via drill 0.35)
  Top 0.203: R17.2 28.37,19.35 28.19,19.18 28.19,17.17 27.86,16.84 25.41,16.84 Q4.2 24.05,17.3 v24.03,17.32 | v12.37,15.56 U$4.13
  Bottom 0.203: v24.03,17.32 23.7,17.65 23.7,18.72 23.5,18.92 12.65,18.92 12.37,18.64 v12.37,15.56
EN  (via drill 0.35)
  Top 0.203: R4.2 35.15,19.7 Q3.3 31.48,19.7 v31.47,19.71 | C14.1 10.72,44.85 11,44.58 11,44.15 S3.2 13.25,44 v13.56,43.69 | U1.3 10.24,23.04 v10.24,25.5 | v61.52,42.47 61.92,42.06 65.2,42.06 65.5,41.76 S5.1
  Bottom 0.203: v31.47,19.71 28.4,19.71 26.29,21.82 22.61,21.82 21.57,22.86 12.29,22.86 11.66,23.5 11.66,25.68 11.3,26.04 10.57,26.04 10.24,25.7 | v61.52,42.47 60.63,43.36 52.83,43.36 52.35,43.84 52.35,45.9 51.6,46.64 14.55,46.64 14.07,46.16 14.07,44.2 v13.56,43.69 13.56,37.49 12.98,36.91 10.92,36.91 9.25,35.23 9.25,27.3 9.25,27.23 9.25,26.7 10.24,25.7 | 10.24,25.7 v10.24,25.5
GND  (via drill 0.35)
  Top 0.203: 8.34,43.09 C14.2 7.95,43.15 7.89,43.09 | R14.2 29.49,45.67 | 15.15,4.65 C19.2 17.02,4.63 v17.02,3.56 | 15.15,4.65 U6.P$2 15.09,4.69 15.09,3.05 | 11.05,6.3 C18.2 10.16,6.35 10.03,6.22 10.03,4.95 9.73,4.65 C20.2 | X1.5 8.21,10.2 8.55,9.86 U$4.1 8.06,8.82 7.87,8.64 7.87,4.95 8.18,4.65 C20.2 | C15.2 7.81,20 7.74,20.07 7.74,20.83 7.97,21.06 8.03,21.06 | U1.1 7.74,21.39 8.03,21.1 8.03,21.06 | v21.49,5.92 v21.5,5.93 U3.2 21.5,11.11 21.31,11.3 20.83,11.3 20.65,11.48 C1.2 20.65,13.39 v20.3,13.74 | U7.2 35,8.08 34.15,8.93 | C22.2 34.15,8.93 | C23.2 17.91,17 v18.47,17.55 | v12.38,21.09 12.15,20.86 R20.2 | v8.38,21.06 8.03,21.06 | v24.99,13.62 25.15,13.46 R1.1 25.15,11.55 25.45,11.25 26.52,11.25 26.85,10.92 | R18.1 26.85,10.92 | C21.2 29.67,12.48 29.67,11.53 29.95,11.25 | 29.95,11.25 30.99,11.25 31.39,10.85 v31.39,8.74 31.35,8.78 | 29.95,11.25 29.67,10.97 28.17,10.97 27.89,11.25 27.18,11.25 26.85,10.92 | 34.15,8.93 33.76,8.53 v33.68,8.53 | v31.57,2.63 31.8,2.4 U$2.P$1 32.9,3.23 33.15,3.48 37.85,3.48 38.28,3.05 39.2,3.05 39.5,3.35 | C16.2 41.85,2.83 41.63,3.05 39.8,3.05 39.5,3.35 | U2.1 39.5,3.35 | v45.01,2.34 45.16,2.49 53.19,2.49 53.5,2.8 U2.8 | U1.38 7.74,42.94 7.89,43.09 | J1.4 65.54,22.36 S5.2 65.5,31 65,31.5 R24.2 | 61.5,11.63 61.17,11.96 J1.2 | 61.5,11.63 J4.1 62.86,9.47 63.04,9.3 63.04,6.68 62.89,6.53 J4.2 | 61.5,11.63 61.83,11.96 J1.5 J1.4 | J1.3 J1.4 | U1.39 v15.24,27.46 15.67,27.03 22.33,27.03 23.57,25.79 U1.15 | 7.89,43.09 7.89,43.12 7.52,43.48 7.52,45.59 7.75,45.82 16.74,45.82 17.15,45.41 | S3.1 17.15,45.41 | 17.15,45.41 17.51,45.77 22.25,45.77 | 22.25,45.77 v22.53,45.49 | 22.25,45.77 22.78,46.3 28.39,46.3 v28.68,46.01 29.15,46.01 29.49,45.67
  Top 0.203: R13.2 34.5,45.68 | R12.2 39.5,45.67 | 34.5,45.68 34.92,46.1 39.06,46.1 39.5,45.67 | 34.5,45.68 34.08,46.1 29.92,46.1 29.49,45.67 | 39.5,45.67 39.91,46.08 44.09,46.08 44.5,45.67 R11.2 43.53,44.85 43.2,44.53 43.2,42.62 43.79,42.04 47.19,42.04 47.77,41.46 C6.2 C3.2 | v35.26,37.49 v35.27,37.5 U$3.V- | U4.1 41.12,34.6 v40.49,35.23 | v52.15,23.42 51.5,22.77 U2.10 | J3.6 51.03,29.59 51.33,29.9 51.33,32.74 50.8,33.27 v49.27,33.27 | v47.08,33.06 46.85,32.83 C7.2 | 41.86,22.96 42.43,22.96 42.45,22.99 43.94,22.99 | 41.15,23.75 41.86,24.46 42.62,24.46 42.88,24.71 42.88,25.48 C17.2 | C24.2 44.45,23.5 43.94,22.99 | 43.94,22.99 43.94,22.96 44.55,22.36 44.55,18.87 43.48,17.8 43.48,16.33 v43.81,16 | U6.P$4 13.05,6.3 14.71,4.65 15.15,4.65 | C20.2 9,3.34 9.3,3.05 15.09,3.05 | 15.09,3.05 16.51,3.05 v17.02,3.56 | C2.2 18.08,2.5 v17.02,3.56 | R10.1 28.85,34.7 v28.96,34.59
  Top 0.213: U8.13 36.25,29.14 35.97,28.85 35.97,25.04 36.35,24.66 38.94,24.66 39.27,24.99 | 39.27,24.99 40.51,23.75 41.07,23.75 41.86,22.96 | 39.27,24.99 39.27,26.39 v39.62,26.75
  Route2 0.203: v17.02,3.56 17.02,3.3 17.3,3.02 21.29,3.02 21.49,3.23 | v21.49,5.92 21.49,3.23 | 21.49,3.23 21.51,3.25 21.74,3.02 24.09,3.02 v24.38,2.73 | v8.38,21.06 8.93,21.61 11.86,21.61 v12.38,21.09 14.22,21.09 14.63,21.5 | v24.99,13.62 24.64,13.97 20.57,13.97 20.34,13.74 v20.3,13.74 19.41,13.74 19.02,14.12 19.02,17 v18.47,17.55 18.47,18.92 19.13,19.58 19.13,20.37 18.41,21.09 15.04,21.09 14.63,21.5 | v33.68,8.53 31.73,8.53 | 31.73,8.53 31.6,8.53 v31.39,8.74 | 31.73,8.53 31.37,8.18 31.37,2.83 v31.57,2.63 31.37,2.43 31.37,1.83 31.7,1.5 39.7,1.5 | v45.01,2.34 44.17,1.5 40.84,1.5 | v15.24,27.46 14.63,26.85 14.63,21.5 | v28.68,46.01 28.31,46.01 27.89,45.59 27.89,37.8 28.37,37.31 28.96,37.31 | 28.96,37.31 35.08,37.31 v35.26,37.49 35.13,37.62 35.13,38.46 35.41,38.73 39.83,38.73 40.31,38.25 40.31,36.93 | v40.49,35.23 40.31,35.41 40.31,36.37 | v28.96,34.59 28.96,37.31
  Route2 0.213: 40.64,36.6 46.3,36.6 46.79,36.12 46.79,33.35 v47.08,33.06 | 40.31,36.93 40.64,36.6 | 40.31,36.37 40.54,36.6 40.64,36.6 | v50.32,16.64 50.58,16.37 | 50.58,16.37 50.6,16.36 52.45,16.36 52.91,16.82 52.91,22.66 v52.15,23.42 | v43.81,16 43.43,15.62 43.43,14.76 | 43.43,14.76 43.92,14.28 50.04,14.28 50.58,14.82 50.58,16.37 | 40.28,2.08 40.28,14.12 40.92,14.76 43.43,14.76 | 39.7,1.5 40.28,2.08 | 40.28,2.08 40.28,2.06 40.84,1.5
  Bottom 0.203: S1.2 24.4,2.72 v24.38,2.73 | S2.1 44.75,15.57 44.32,16 | U$1.2 48.73,5.5 48.51,5.71 48.51,6.07 48.23,6.35 C5.2 46.41,6.35 46.15,6.1 46.15,4.83 45.98,4.65 C4.2 v45.01,2.34 45.34,2.01 55.93,2.01 56.46,2.54 56.46,5.92 56.03,6.35 | R3.2 56.03,6.35 | 56.03,6.35 56.5,6.82 C9.2 57.94,9.15 58.24,9.45 58.24,11.63 58.57,11.96 J1.2 J1.3 | v22.53,45.49 v22.54,45.5 S4.2 | C13.2 45.35,19.18 45.33,19.18 44.77,18.62 44.77,17.5 S2.2 44.75,16.43 44.32,16 | C12.2 48.65,24.06 49.12,24.54 | 49.12,24.54 51.74,24.54 52.15,24.13 v52.15,23.42 | 49.12,24.54 48.64,25.02 48.64,29.03 49.2,29.59 J3.6 | v49.27,33.27 47.3,33.27 v47.08,33.06 | v43.81,16 44.32,16
  Bottom 0.213: U5.15 48.82,16.64 v50.32,16.64 | v39.62,26.75 39.98,27.1 J2.1
  pour Top (isolate 0.254): 6.6,47 6.6,15.2 0,15.2 0,14.9 0,0 67,0 67,9.5 67,47 60.5,47
  pour Route2 (isolate 0.254): 6.6,47 6.6,15.2 0,15.2 0,0 67,0 67,1.8 67,47
  pour Bottom (isolate 0.254): 6.6,47 6.6,15.2 5.7,15.2 0,15.2 0,15.1 0,0 2.7,0 67,0 67,3.1 67,47 61.9,47
IO0  (via drill 0.35)
  Top 0.203: Q4.3 21.35,19.7 R5.2 20.34,19.35 v19.76,19.94 | v9.39,24.84 9.39,27.18 | 9.39,27.18 9.4,27.18 | 9.39,27.18 9.39,35.41 10.69,36.7 22.15,36.7 24.25,38.8 U1.25
  Bottom 0.203: v19.76,19.94 18.97,20.73 13.74,20.73 12.65,21.82 10.16,21.82 9.39,22.58 v9.39,24.84
LED_BT
  Top 0.203: LED3.A 36.5,42.09 36.27,41.86 19.58,41.86 19.17,41.45 U1.29
LED_MODEM
  Top 0.203: U1.26 22.98,41.19 23.29,41.5 41.12,41.5 41.5,41.88 LED2.A
LED_RFR  (via drill 0.35)  (1 unrouted)
  Top 0.203: LED4.A 32.59,42.95 v32.79,42.75 | v24.97,24.49 24.64,24.82 23.27,24.82 22.98,24.53
  Bottom 0.203: v32.79,42.75 32.79,22.33 32.49,22.02 28.35,22.02 27.05,23.32 25.48,23.32 24.97,23.82 v24.97,24.49
MISO  (via drill 0.35)
  Top 0.203: U1.31 16.63,37.76 15.95,37.08 10.1,37.08 v9.93,36.91 | U2.2 41.5,3.58 41.68,3.4 42.42,3.4 42.8,3.02 42.8,1.54 42.43,1.17 30.33,1.17 29.97,0.81 23.22,0.81 22.92,0.51 22.38,0.51 22.02,0.86 11.69,0.86 v11.37,1.18
  Bottom 0.203: v9.93,36.91 8.76,35.74 8.76,22.38 9.47,21.67 9.47,20.55 8.74,19.81 8.74,13.13 11.05,10.82 11.05,1.5 v11.37,1.18
MOSI  (via drill 0.35)
  Top 0.203: U1.37 v9.01,36.91 v9.02,36.91 | U2.3 43.5,3.13 v43.51,3.12
  Bottom 0.203: v9.02,36.91 8.26,36.14 8.26,22.2 9.02,21.44 9.02,20.75 8.26,19.99 8.26,12.85 10.52,10.59 10.52,1.14 11.15,0.51 43.81,0.51 44.02,0.71 44.02,2.41 43.51,2.92 v43.51,3.12
N$1
  Top 0.203: R11.1 44.5,43.99 44.58,44.07 46.35,44.07 46.5,44.21 LED1.C
N$2
  Top 0.61: J3.1 55.63,35.95 56.01,36.32 56.01,38.32 F1.2
N$3
  Top 0.203: R16.1 33.25,12.5 33.05,12.29 33.05,7.37 33.23,7.18 U7.3
N$4
  Top 0.203: U3.3 20.55,9.9 R2.1
N$5
  Bottom 0.203: R3.1 52.38,4.65 U$1.5
N$6
  Bottom 0.203: U5.6 56.35,11.6 56.52,11.43 56.52,10.87 C9.1
N$7
  Top 0.203: R12.1 39.5,43.95 39.62,44.07 41.27,44.07 41.5,44.29 LED2.C
N$8
  Bottom 0.203: U5.4 56.28,14.13 C11.2
N$9
  Bottom 0.203: U5.5 56.28,12.87 C11.1
N$10
  Bottom 0.203: U5.1 56.41,17.95 C10.2
N$11
  Bottom 0.203: U5.3 56.32,15.4 56.5,15.58 C10.1
N$12
  Top 0.203: R13.1 34.5,43.9 34.67,44.07 36.32,44.07 36.5,44.25 LED3.C
N$13
  Top 0.203: R14.1 29.5,43.98 29.59,44.07 31.24,44.07 31.5,44.33 LED4.C
N$14
  Top 0.203: 22.45,9.9 R2.2 | D2.C 30.75,15 31.35,14.39
  Top 0.406: 22.45,9.9 U3.1 22.91,7.18 23.62,6.48 23.62,4.24 24.16,3.71 31.04,3.71 31.45,4.12 Q2.2 31.45,5.95 32.36,6.86 | 31.35,14.39 C21.1 32.1,12.5 32.36,12.24 32.36,6.86 | 32.36,6.86 33.2,6.02 35.64,6.02 35.95,6.33 U7.1
N$15
  Top 0.203: C20.1 9,7.09 9.27,7.37 11.3,7.37 12.37,8.43 U$4.4
N$17
  Bottom 0.203: C8.1 53.85,18.7 53.67,18.52 52.53,18.52 52.3,18.29 52.3,16.94 52.56,16.68 U5.2
N$18
  Top 0.406: X1.1 6.96,12.8 7.49,13.34 7.49,16.51 7.98,17 F3.1
N$19  (via drill 0.35)
  Top 0.203: R25.1 42.27,27.5 42.01,27.76 42.01,32.49 v42.34,32.82 | v44.61,30.01 44.61,29.73 44.9,29.45 45.9,29.45 D3.C
  Bottom 0.203: v42.34,32.82 42.39,32.87 44.27,32.87 44.78,32.36 44.78,30.18 v44.61,30.01
N$20
  Top 0.203: Q3.1 29.85,17.3 R17.1
N$23
  Top 0.203: Q4.1 23.05,18.1 23.37,18.41 26.8,18.41 27,18.21 R19.1
N$26
  Bottom 0.203: F2.2 44.17,24.75 43.5,25.42 J2.2
NSS  (via drill 0.35)
  Top 0.203: U2.5 47.5,6.93 v46.2,8.23 | v34.52,25 34.21,25.3 34.21,33.76 33.6,34.37 30.61,34.37 30,34.98 30,36.55 29.33,37.22 27.74,37.22 | 27.74,37.22 U1.24 | R10.2 27.67,37.15 27.74,37.22
  Bottom 0.203: v46.2,8.23 46,8.43 46,18.87 46.18,19.05 46.18,20.75 45.74,21.18 43.28,21.18 42.8,21.67 42.8,24.31 42.42,24.69 40.08,24.69 39.78,24.99 v34.52,24.99 v34.52,25
PB1  (via drill 0.35)
  Top 0.203: U1.12 21.71,21.72 v22,21.44
  Bottom 0.203: C13.1 R9.1 41.4,19.95 41.4,17.73 41.15,17.48 S2.4 S2.3 40.2,9.47 38.46,9.47 37.92,10.01 27.99,10.01 27.3,10.69 27.3,12.85 27.33,12.88 27.33,20.04 25.93,21.44 v22,21.44
REED  (via drill 0.35)
  Top 0.203: U1.11 20.44,20.69 v20.42,20.68
  Bottom 0.203: R8.1 42.5,1.6 S1.1 26.29,1.5 25.78,2.01 25.78,15.75 26.26,16.23 26.26,19.68 25.86,20.09 21.01,20.09 v20.42,20.68
REED1  (via drill 0.35)
  Top 0.203: U1.10 19.17,24.23 19.66,24.72 v22.35,24.72 | v31.7,24.54 32.01,24.23 34.82,24.23 35.15,24.56 v35.15,35.18
  Bottom 0.203: v22.35,24.72 23.08,25.45 30.61,25.45 31.52,24.54 v31.7,24.54 | v35.15,35.18 35.15,36.45 35.69,36.98 42.04,36.98 42.6,37.55 S4.1 42.61,45.49 R23.1
RFM_RST  (via drill 0.35)
  Top 0.203: U1.8 16.63,24.78 17.83,25.98 v19.89,25.98 | v33.47,25.68 31.83,25.68 v31.78,25.63 | v48.59,8.23 49.08,8.23 49.51,7.8 U2.6
  Bottom 0.203: v31.78,25.63 31.42,25.98 v19.89,25.98 | v33.47,25.68 39.88,25.68 40.54,25.02 42.9,25.02 43.28,24.64 43.28,21.89 43.59,21.59 45.95,21.59 46.58,20.95 46.58,8.74 47.09,8.23 v48.59,8.23
RTS  (via drill 0.35)
  Top 0.203: Q3.2 33.45,18.24 33.15,18.54 30.99,18.54 30.73,18.8 30.73,20.07 30.23,20.57 27.56,20.57 27,20.02 R19.2 26.95,19.3 v25.53,19.3 | v11.1,15.57 U$4.14
  Bottom 0.203: v25.53,19.3 11.38,19.3 11.1,19.02 v11.1,15.57
RX_ESP  (via drill 0.35)
  Top 0.203: v47.22,12.88 v38.02,12.88 | v34.46,20.42 34.46,20.63 33.33,21.77 31.42,21.77 30.83,22.36 v30.83,22.65 | U1.27 v21.71,38.06 v21.72,38.05 | v30.83,27.25 v30.83,23.98 v30.84,23.98
  Bottom 0.203: U5.12 47.23,12.87 v47.22,12.88 | v38.02,12.88 34.85,12.88 34.47,13.26 34.47,16.61 34.46,16.61 v34.46,20.42 | v30.83,22.65 30.83,23.82 30.84,23.82 v30.84,23.98 | v21.72,38.05 21.72,28.7 22.15,28.27 29.8,28.27 30.81,27.25 v30.83,27.25
RX_RJ45
  Bottom 0.203: U5.13 50.02,14.13 50.27,14.38 50.27,15.65 49.86,16.05 47.68,16.05 47.45,16.28 47.45,30.28 48.03,30.86 J3.5
SCK  (via drill 0.35)
  Top 0.203: U1.30 17.9,41.55 v18.14,41.78 | v31.9,40.87 41.15,40.87 41.76,40.26 41.76,36.63 v42.8,35.59 | v48.41,34.82 48.64,34.59 48.64,24.51 49,24.16 50.29,24.16 v51.05,23.39 | v51.16,9.3 50.93,9.07 45.97,9.07 45.5,8.59 U2.4
  Bottom 0.203: v18.14,41.78 18.19,41.83 30.94,41.83 v31.9,40.87 | v42.8,35.59 47.65,35.59 v48.41,34.82 | v51.05,23.39 51.05,21.57 51.49,21.13 52.58,21.13 53.05,20.66 53.05,19.19 52.78,18.92 52.02,18.92 51.74,18.64 51.74,9.88 v51.16,9.3
SCL  (via drill 0.35)
  Top 0.203: R27.2 41.15,30.63 40.94,30.42 v40.15,30.42 | v35.89,32.61 36.22,32.95 U8.16 | U1.36 10.28,42.21 10.9,42.82 24.69,42.82 v24.99,43.13
  Bottom 0.203: v40.15,30.42 36.48,30.42 35.89,31.01 v35.89,32.61 35.56,32.94 34.92,32.94 34.42,33.45 34.42,44.22 34.04,44.6 26.47,44.6 v24.99,43.13
SDA  (via drill 0.35)
  Top 0.203: R26.2 40.09,29.5 v40.08,29.52 | v35.99,29.87 35.89,29.97 35.89,31.34 36.22,31.68 U8.15 | U1.33 14.09,42.01 14.58,42.49 25.43,42.49 v25.83,42.49
  Bottom 0.203: v40.08,29.52 36.35,29.52 v35.99,29.87 35.66,29.54 34.21,29.54 33.78,29.97 33.78,43.51 33.43,43.87 27.21,43.87 v25.83,42.49
SWITCH1  (via drill 0.35)
  Top 0.203: U1.14 24.25,21.29 24.82,20.73 24.82,19.07 24.51,18.77 22.5,18.77 22.1,18.36 22.1,17.48 22.1,17.25 21.49,16.64 20.5,16.64 20.17,16.31 v20.17,14.84 | v22.66,1.14 29.62,1.14 29.85,1.38 R6.2 31.6,2 32.09,1.51 33.67,1.51 34.56,2.4 U$2.P$2 38.22,2.4 38.62,2 C16.1
  Bottom 0.203: v20.17,14.84 19.48,14.15 19.48,1.63 19.96,1.14 v22.66,1.14
TX_ESP  (via drill 0.35)
  Top 0.203: v47.22,11.61 v37.74,11.61 | v29.92,22.65 29.92,21.95 30.56,21.31 32.69,21.31 v33.55,20.45 | v29.92,24.03 v29.92,27.25 | v20.45,38.08 U1.28
  Bottom 0.203: U5.11 47.23,11.6 v47.22,11.61 | v37.74,11.61 34.14,11.61 33.55,12.19 v33.55,20.45 | v29.92,22.65 v29.92,24.03 | v29.92,27.25 29.51,27.66 20.95,27.66 20.45,28.17 v20.45,38.08
TX_RJ45
  Bottom 0.203: U5.14 47.64,15.4 46.99,16.05 46.99,31.45 47.68,32.13 J3.4
USB_N
  Top 0.137: X1.2 6.27,12.15 6.47,11.96 13.55,11.96 14.4,11.11 14.4,10.43 14.9,9.93 U$4.6
USB_P
  Top 0.137: X1.3 6.27,11.5 6.47,11.69 13.44,11.69 14.14,11 14.14,10.43 13.63,9.93 U$4.5
VBACKUP
  Top 0.406: U$3.V+ 38.83,39.5 39.45,38.89 39.45,30.76 39.12,30.43 39.12,30.4 | C17.1 R25.2 39.81,27.5 39.12,28.19 39.12,30.4 | U8.14 39.12,30.41 39.12,30.4
VBAT  (via drill 0.35)
  Top 0.406: Q2.3 v30.5,5.92 | v18.41,19.94 18.35,20 R15.1
  Route15 0.406: 43.99,7.44 v43.99,7.52 | 39.4,23.24 v39.45,23.29
  Route15 0.61: v30.5,5.92 30.5,5.21 | v18.41,19.94 19.33,19.02 19.33,5.26 19.84,4.75 30.05,4.75 30.5,5.21 | 30.5,5.21 31.01,4.7 37.54,4.7 38.08,5.23 38.08,6.66 38.53,7.11 43.66,7.11 43.99,7.44 | v42.75,13.61 40.21,13.61 39.4,14.43 39.4,23.24
  Bottom 0.406: C4.1 45,7.23 | U$1.3 49.7,7.01 49.23,7.49 45.26,7.49 45,7.23 | 45,7.23 44.71,7.52 v43.99,7.52 43.36,8.15 43.36,13.01 v42.75,13.61 | v39.45,23.29 39.45,23.34 39.81,23.7 40.62,23.7 F2.1
X1
  Top 0.203: 16.13,8.87 U$4.7 16.18,7.79 15.85,7.47 12.19,7.47 11.83,7.11 11.83,4.65 | U6.P$1 12.85,4.65 11.83,4.65 | C18.1 11.73,4.65 11.83,4.65
X2
  Top 0.203: U6.P$3 16.95,6.3 C19.1 17,7.22 17.45,7.67 U$4.8

### Text on the board
bPlace: ARESTER V1